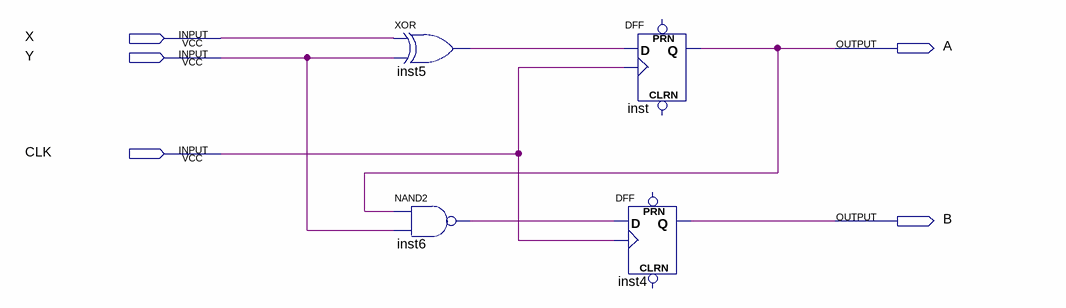
[diagram p0: schematic sheet]
// Quartus schematic B0729056_LAB1.bdf as structural Verilog: 4 symbols, 5 pins
module B0729056_LAB1 (
  input  X,
  input  Y,
  input  CLK,
  output A,
  output B
);

  wire inst5_out, inst6_out;

  xor inst5 (inst5_out, X, Y);
  nand inst6 (inst6_out, A, Y);
  DFF inst4 (.CLK(CLK), .D(inst6_out), .Q(B));  // open: CLRN, PRN
  DFF inst (.CLK(CLK), .D(inst5_out), .Q(A));  // open: CLRN, PRN
endmodule
